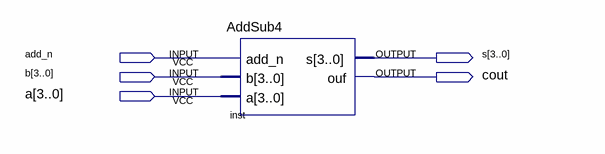
[diagram p0: schematic sheet]
// Quartus schematic AddSumDemo.bdf as structural Verilog: 1 symbols, 5 pins
module AddSumDemo (
  input  add_n,
  input  [3:0] b,
  input  [3:0] a,
  output [3:0] s,
  output cout
);

  AddSub4 inst (.add_n(add_n), .b(b), .a(a), .s(s), .ouf(cout));
endmodule
